# EAGLE design Carrier_for-Addons-V01-004 (EAGLE 9.1.1)
MAPLE-CUx Large Version
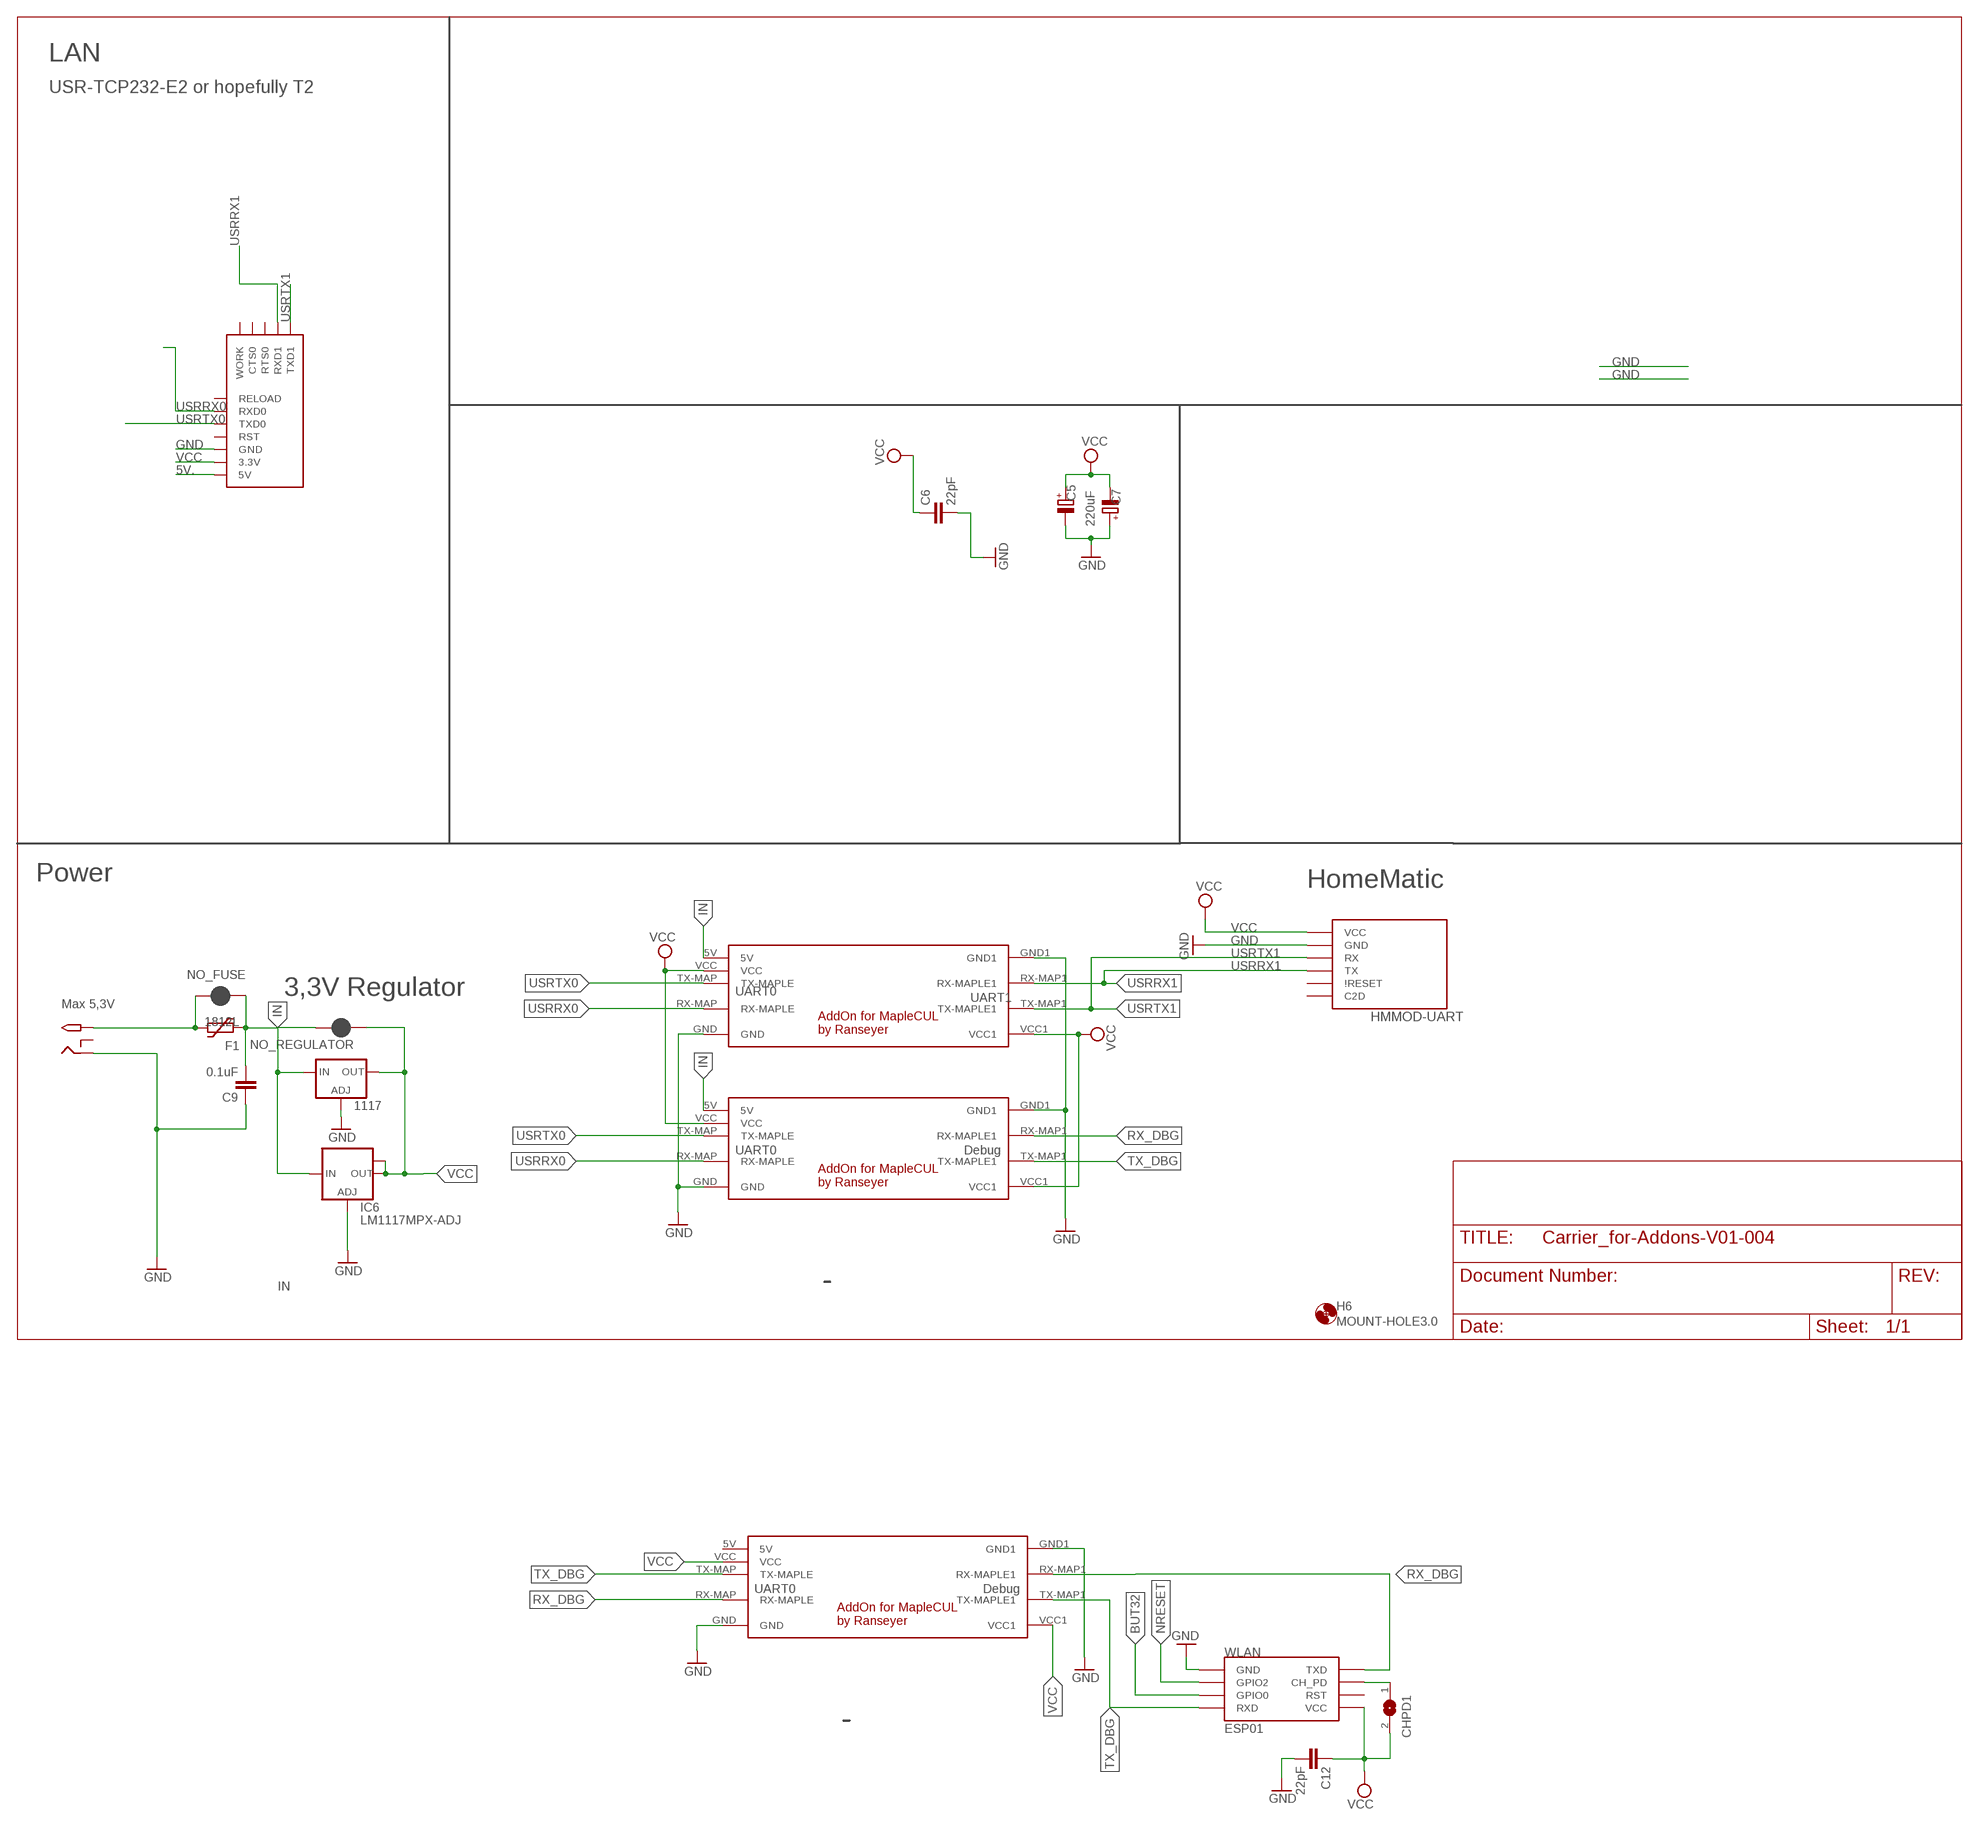
[diagram p0: schematic, sheet 1, part 1 of 2]
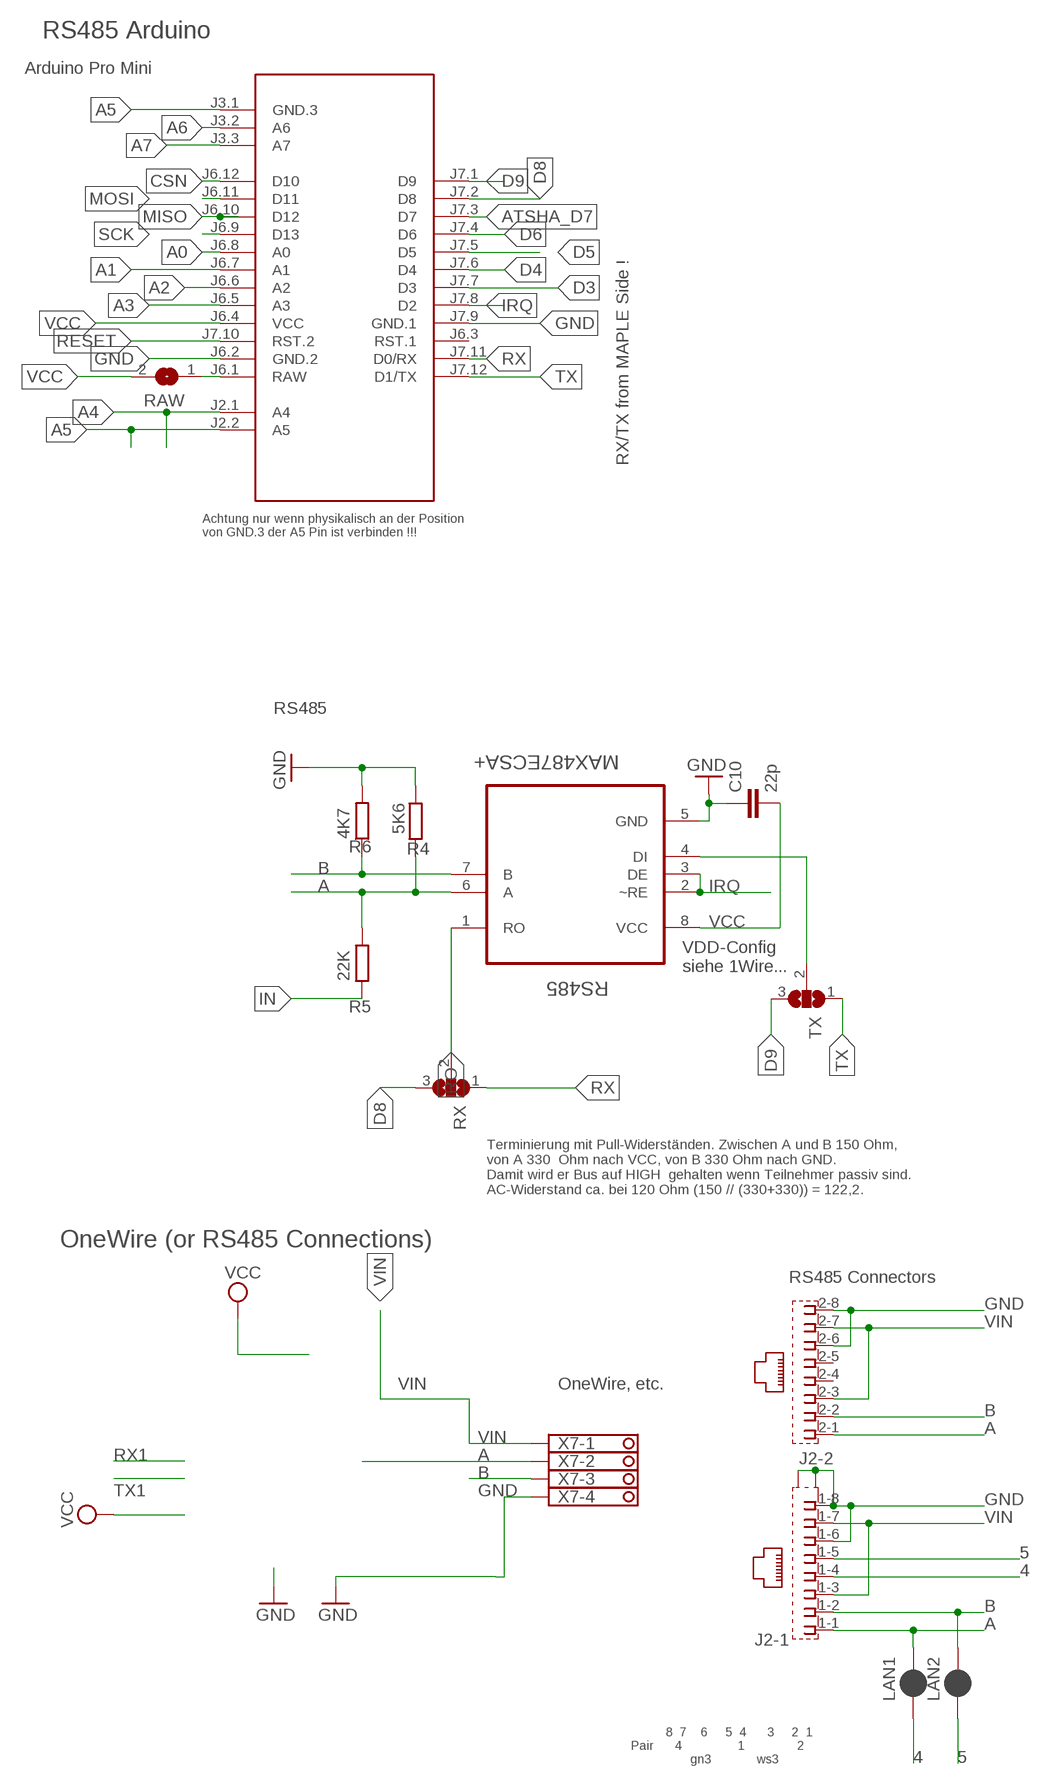
[diagram p1: schematic, sheet 1, part 2 of 2]

## Parts
1117  LD117ADT50TR  [DPACK]
C5  220uF  CPOL-EUE5-8.5  [E5-8,5]
C6  22pF  C-EUC0805  [C0805]
C7  CPOL-EUSMCE  [SMC_E]
C9  0.1uF  C-EUC1206  [C1206]
C10  22p  C-EUC0805  [C0805]
C12  22pF  C-EUC0805  [C0805]
CHPD1  SJ  [SJ]
F1  1812L  [1812L]
H6  MOUNT-HOLE3.0  [3,0]
HMMOD-UART  HM-MOD-UARTDIL  [HM-MOD-UART-DIL]
IC6  LM1117MPX-ADJ  [SOT223]
J2  RJ45_2X_S  [RJ45_2X_S]
LAN1  JUMPER-SMT_2_NC_PASTE_SILK  [SMT-JUMPER_2_NC_PASTE_SILK]
LAN2  JUMPER-SMT_2_NC_PASTE_SILK  [SMT-JUMPER_2_NC_PASTE_SILK]
M1  ARDUINO-PRO-MINI-3.3V#NP  [ARDUINO-PRO-MINI#NP]
NO_FUSE  JUMPER-SMT_2_NC_PASTE_NO-SILK  [SMT-JUMPER_2_NC_PASTE_NO-SILK]
NO_REGULATOR  JUMPER-SMT_2_NC_PASTE_NO-SILK  [SMT-JUMPER_2_NC_PASTE_NO-SILK]
R4  5K6  R-EU_R0805  [R0805]
R5  22K  R-EU_R0805  [R0805]
R6  4K7  R-EU_R0805  [R0805]
RAW  SJ  [SJ]
RS485  MAX487ECSA+  [SOIC127P600X175-8N]
RX  SJ2W  [SJ_2]
TX  SJ2W  [SJ_2]
U$1  MAPLE-CUL-ADDON-V01  [MAPLE-CUL-V01]
U$2  2.1MMJACKTHM  [PJ-102A]
U$3  MAPLE-CUL-ADDON-V01  [MAPLE-CUL-V01]
U$4  MAPLE-CUL-ADDON-V01  [MAPLE-CUL-V01]
U$5  USR-TCP232-E2  [USR-TCP232-E2]
WLAN  ESP01  [ESP01]
X7  1751264  [1751264]

## Nets
4: J2.1-4 LAN1.1
5: J2.1-5 LAN2.1
5V.: U$5.5V
A: J2.1-1 J2.2-1 LAN1.2 R4.2 R5.2 RS485.6(A) X7.2
A0: M1.J6.8(A0)
A1: M1.J6.7(A1)
A2: M1.J6.6(A2)
A3: M1.J6.5(A3)
A4: M1.J2.1(A4)
A5: M1.J2.2(A5) M1.J3.1(GND.3)
A6: M1.J3.2(A6)
A7: M1.J3.3(A7)
ATSHA_D7: M1.J7.3(D7)
B: J2.1-2 J2.2-2 LAN2.2 R6.1 RS485.7(B) X7.3
BUT32: WLAN.GPIO0
CSN: M1.J6.12(D10)
D3: M1.J7.7(D3)
D4: M1.J7.6(D4)
D5: M1.J7.5(D5)
D6: M1.J7.4(D6)
D8: M1.J7.2(D8) RX.3
D9: M1.J7.1(D9) TX.3
DI1: RS485.4(DI) TX.2
GND [Power]: 1117.1(ADJ) C5.- C6.2 C7.+ C9.1 C10.1 C12.2 HMMOD-UART.2(GND) IC6.1(ADJ) J2.1-6 J2.1-8 J2.2-6 J2.2-8 J2.G1(-1:S2) J2.G3(-1:S1) M1.J6.2(GND.2) M1.J7.9(GND.1) R4.1 R6.2 RS485.5(GND) U$1.GND U$1.GND1 U$2.RING U$3.GND U$3.GND1 U$4.GND U$4.GND1 U$5.GND WLAN.GND X7.4
IN [Power]: 1117.3(IN) C9.2 F1.P$1 IC6.3(IN) NO_FUSE.1 NO_REGULATOR.2 R5.1 U$3.5V U$4.5V
IRQ: M1.J7.8(D2) RS485.2(~RE) RS485.3(DE)
MISO: M1.J6.10(D12)
MOSI: M1.J6.11(D11)
N$2: CHPD1.1 WLAN.CH_PD
NRESET: WLAN.GPIO2
RAW1 [Power]: M1.J6.1(RAW) RAW.1
RESET: M1.J7.10(RST.2)
RO: RS485.1(RO) RX.2
RX: M1.J7.11(D0/RX) RX.1
RX_DBG: U$1.RX-MAP1(RX-MAPLE1) U$1.RX-MAP(RX-MAPLE) U$4.RX-MAP1(RX-MAPLE1) WLAN.TX(TXD)
SCK: M1.J6.9(D13)
TX: M1.J7.12(D1/TX) TX.1
TX_DBG: U$1.TX-MAP1(TX-MAPLE1) U$1.TX-MAP(TX-MAPLE) U$4.TX-MAP1(TX-MAPLE1) WLAN.RX(RXD)
USRRX0: U$3.RX-MAP(RX-MAPLE) U$4.RX-MAP(RX-MAPLE) U$5.RXD0
USRRX1: HMMOD-UART.5(TX) U$3.RX-MAP1(RX-MAPLE1) U$5.RXD1
USRTX0: U$3.TX-MAP(TX-MAPLE) U$4.TX-MAP(TX-MAPLE) U$5.TXD0
USRTX1: HMMOD-UART.6(RX) U$3.TX-MAP1(TX-MAPLE1) U$5.TXD1
VCC [Power]: 1117.4(OUT) C5.+ C6.1 C7.- C10.2 C12.1 CHPD1.2 HMMOD-UART.1(VCC) IC6.2(OUT) IC6.TAB(OUT1) M1.J6.4(VCC) NO_REGULATOR.1 RAW.2 RS485.8(VCC) U$1.VCC U$1.VCC1 U$3.VCC U$3.VCC1 U$4.VCC U$4.VCC1 U$5.3.3V WLAN.VCC
VIN [Power]: F1.P$2 J2.1-3 J2.1-7 J2.2-3 J2.2-7 NO_FUSE.2 U$2.TIP X7.1
Unconnected: HMMOD-UART.3(C2D) HMMOD-UART.4(\!RESET) J2.2-4 J2.2-5 M1.J6.3(RST.1) U$1.5V U$2.RING_SW U$5.CTS0 U$5.RELOAD U$5.RST U$5.RTS0 U$5.WORK WLAN.RST

## Notes on the sheet
- LAN
- USR-TCP232-E2 or hopefully T2
- RS485 Arduino
- Arduino Pro Mini
- RX/TX from MAPLE Side !
- Achtung nur wenn physikalisch an der Position 
  von GND.3 der A5 Pin ist verbinden !!!
- RS485
- VDD-Config
  siehe 1Wire...
- Power | HomeMatic
- Terminierung mit Pull-Widerständen. Zwischen A und B 150 Ohm,
  von A 330  Ohm nach VCC, von B 330 Ohm nach GND. 
  Damit wird er Bus auf HIGH  gehalten wenn Teilnehmer passiv sind.
  AC-Widerstand ca. bei 120 Ohm (150 // (330+330)) = 122,2.
- OneWire (or RS485 Connections)
- 3,3V Regulator | UART0
- UART1 | RS485 Connectors
- Max 5,3V
- OneWire, etc.
- UART0 | Debug
- 8  7    6     5  4      3     2  1
  Pair      4                1               2
                   gn3             ws3
- UART0 | Debug

## Library data of the parts
1117 = v-reg:LD117A?*: Low drop fixed and adjustable positive voltage regulators 1 A Source: http://www.st.com/stonline/products/literature/ds/7194/ld1117axx.pdf
C5 = rcl:CPOL-EU: POLARIZED CAPACITOR, European symbol
C6 C9 C10 C12 = rcl:C-EU: CAPACITOR, European symbol
C7 = rcl:CPOL-EU: POLARIZED CAPACITOR, European symbol; SPICEPREFIX: C
CHPD1 RAW = jumper:SJ: SMD solder JUMPER
F1 = ptc-littlefuse:1812L
H6 = holes:MOUNT-HOLE: MOUNTING HOLE with drill center marker
HMMOD-UART = wireless:HM-MOD-UART: eQ3 HM-MOD-UART-AW-SH2 wireless module for 868 MHz. DIL version for mounting with pin header (antenna upwards) and SMD variant available (antenna downwards).
IC6 = lm1117:LM1117MPX-ADJ
J2 = RJ45:RJ45_2X_S: AMP connector
LAN1 LAN2 NO_FUSE NO_REGULATOR = SparkFun-Jumpers:JUMPER-SMT_2_NC_PASTE: Normally closed solder jumper This jumper has an aperture in the stencil to allow solder paste to bridge the split in the wire so it's normally closed (NC). Wick off the solder to open the connection. Reapply solder to reclose the connection.
M1 = diy-modules:ARDUINO-PRO-MINI-*#NP: Arduino Pro Mini without programming pads
R4-R6 = rcl:R-EU_: RESISTOR, European symbol
RS485 = Maxim_By_element14_Batch_1:MAX487ECSA+: Low-Power, Slew-Rate-Limited RS-485/RS-422 Transceivers; MPN: MAX487ECSA+; OC_FARNELL: 9724532; OC_NEWARK: 68K4803; PACKAGE: SOIC-8; SUPPLIER: Maxim
RX TX = jumper:SJ2W: SMD solder JUMPER
U$1 U$3 U$4 = Martin-Communication-V4:MAPLE-CUL-ADDON-V01: AddOn for MAPLE-CUL V4.x
U$2 = adafruit:2.1MMJACK: 2.1mm x 5.5mm THM DC jack with internal switch. Digikey part #PJ-102A, 4UCON part #05537 2.1mm x 5.5mm SMT DC jack with internal switch. Digikey part #PJ-002A-SMT, 4UCON part #03267 By microbuilder.eu & adafruit.com
U$5 = #Usr-tcp232:USR-TCP232-E2
WLAN = esp8266modules:ESP01: ESP8266 Wifi module 01
X7 = con-phoenix-350:1751264: MKDS 1/ 4-3,5 Printklemme Nennstrom: 10 A Bemessungsspannung: 160 V Raster: 3,5 mm Polzahl: 4 Montageart: Löten Anschlussart: Schraubanschluss Anschlussrichtung vom Leiter zur Platine: 0° Source: http://eshop.phoenixcontact.com .. 1751264.pdf; MPN: 1751264; OC_FARNELL: unknown; OC_NEWARK: 10R0934

## Net classes
0 default: width 0.457 mm
1 Power: width 0.914 mm

## Board
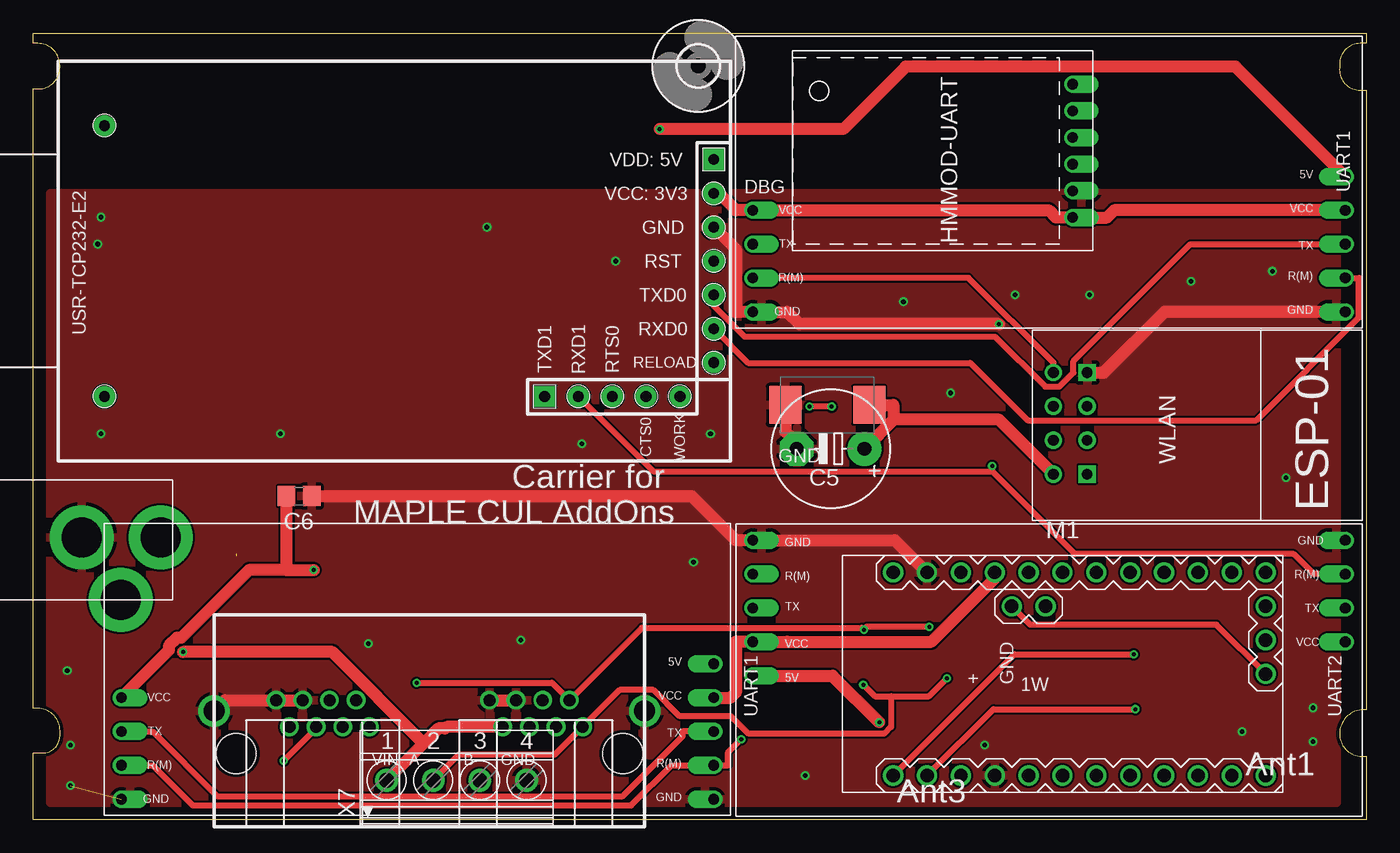
[diagram p2: board, top side]
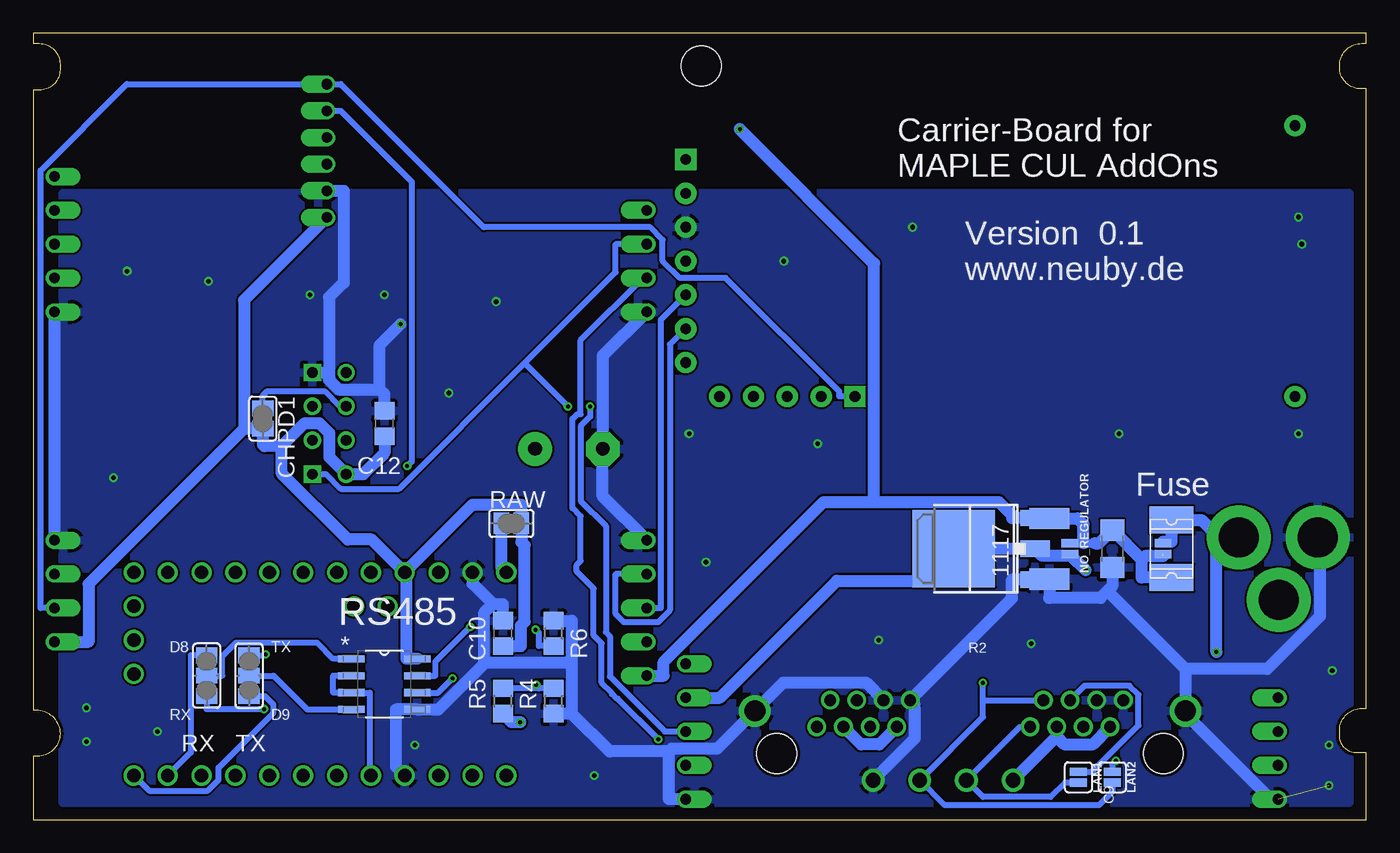
[diagram p3: board, bottom side, seen from below]

Size 100 x 59 mm. Coordinates in mm from the lower left corner, seen from the top.
Outline: 0,0 0,5 0.71,5 arc90 2,6.29 2,6.67 arc90 0.32,8.35 0,8.35 0,37 0,54.83 0.39,54.83 arc90 2,56.44 2,56.57 arc90 0.33,58.24 0,58.24 0,59 100,59 100,58.24 99.54,58.24 arc90 98,56.7 98,56.41 arc90 99.41,54.75 100,54.75 100,8.24 99.8,8.24 arc90 98,6.44 arc90 99.69,4.75 100,4.75 100,0 0,0
Copper layers (1*16): Top 0.035mm / dielectric 1.5mm / Bottom 0.035mm
Design rules "SeeedStudio_2layer_DRU_no_angle_20140221": minimum track width 6mil, minimum drill 12mil, track to track 6mil, track to pad 6mil, pad to pad 6mil, via to via 6mil, smd to smd 0mil, copper to edge 10mil, drill to drill 10mil, minimum pad ring 10mil, minimum via ring 6mil, stop-mask expansion 2mil, vias tented up to drill 100mil, thermal gap 10mil

### Footprints (pad centres in the part's own frame; a part is rotated, then mirrored left to right if it is on the bottom)
DPACK = smd 1.6 x 3: 1 -2.28,-4.8; 3 2.28,-4.8 | smd 5.8 x 6.2: 4 0,2.38
E5-8,5 = drill 1.016 pad 2.54: + -2.54,0 | drill 1.016 pad 2.54 octagon: - 2.54,0
C0805 = smd 1.3 x 1.5: 1 -0.95,0; 2 0.95,0
SMC_E = smd 2.4 x 2.8: + -3.15,0; - 3.15,0
C1206 = smd 1.6 x 1.8: 1 -1.4,0; 2 1.4,0
SJ = smd 1.168 x 1.6: 1 -0.762,0; 2 0.762,0
1812L = smd 2.03 x 3.3: P$1 -2.16,0; P$2 2.16,0
3,0 = hole 3: 0,0
HM-MOD-UART-DIL = drill 0.8 offset: 1 0,12; 2 0,10; 3 0,8; 4 0,6; 5 0,4; 6 0,2
SOT223 = smd 1.219 x 2.235: 1 -2.311,-3.099; 2 0,-3.099; 3 2.311,-3.099 | smd 3.6 x 2.2: TAB 0,3.099
RJ45_2X_S = drill 0.889: 1-1 -4.5,2; 1-2 -5.5,4; 1-3 -6.5,2; 1-4 -7.5,4; 1-5 -8.5,2; 1-6 -9.5,4; 1-7 -10.5,2; 1-8 -11.5,4; 2-1 11.5,2; 2-2 10.5,4; 2-3 9.5,2; 2-4 8.5,4; 2-5 7.5,2; 2-6 6.5,4; 2-7 5.5,2; 2-8 4.5,4 | drill 1.575 pad 2.184: G1 -16.15,3.2; G3 16.15,3.2 | hole 3: -14.5,0; 14.5,0
SMT-JUMPER_2_NC_PASTE_SILK = smd 0.635 x 1.27: 1 -0.406,0; 2 0.406,0
ARDUINO-PRO-MINI#NP = drill 1: J2.1 -1.27,5.08; J2.2 -3.81,5.08; J3.1 15.24,0; J3.2 15.24,2.54; J3.3 15.24,5.08; J6.1 -12.7,7.62; J6.2 -10.16,7.62; J6.3 -7.62,7.62; J6.4 -5.08,7.62; J6.5 -2.54,7.62; J6.6 0,7.62; J6.7 2.54,7.62; J6.8 5.08,7.62; J6.9 7.62,7.62; J6.10 10.16,7.62; J6.11 12.7,7.62; J6.12 15.24,7.62; J7.1 15.24,-7.62; J7.2 12.7,-7.62; J7.3 10.16,-7.62; J7.4 7.62,-7.62; J7.5 5.08,-7.62; J7.6 2.54,-7.62; J7.7 0,-7.62; J7.8 -2.54,-7.62; J7.9 -5.08,-7.62; J7.10 -7.62,-7.62; J7.11 -10.16,-7.62; J7.12 -12.7,-7.62
SMT-JUMPER_2_NC_PASTE_NO-SILK = smd 0.635 x 1.27: 1 -0.406,0; 2 0.406,0
R0805 = smd 1.3 x 1.5: 1 -0.95,0; 2 0.95,0
SOIC127P600X175-8N = smd 1.981 x 0.533: 1 -2.464,1.905; 2 -2.464,0.635; 3 -2.464,-0.635; 4 -2.464,-1.905; 5 2.464,-1.905; 6 2.464,-0.635; 7 2.464,0.635; 8 2.464,1.905
SJ_2 = smd 1.168 x 1.6: 1 -1.524,0; 2 0,0; 3 1.524,0
MAPLE-CUL-V01 = drill 0.8 offset: 5V 1.27,2.54; GND 1.27,12.7; GND1 45.72,12.7; RX-MAP 1.27,10.16; RX-MAP1 45.72,10.16; TX-MAP 1.27,7.62; TX-MAP1 45.72,7.62; VCC 1.27,5.08; VCC1 45.72,5.08
PJ-102A = drill 3 pad 4.8: RING 0.1,-3.39; RING_SW -4.6,-6.29; TIP 0.1,-9.29
USR-TCP232-E2 = drill 0.8 pad 1.6: 3.3V 1.27,9.906; CTS0 6.35,25.146; GND 1.27,12.446; P$13 46.99,25.146; P$14 46.99,4.826; RELOAD 1.27,22.606; RST 1.27,14.986; RTS0 8.89,25.146; RXD0 1.27,20.066; RXD1 11.43,25.146; TXD0 1.27,17.526; WORK 3.81,25.146 | drill 0.8 pad 1.6 square: 5V 1.27,7.366; TXD1 13.97,25.146
ESP01 = drill 0.8: CH_PD -1.285,-8.178; GPIO0 1.255,-5.638; GPIO2 -1.285,-5.638; RST 1.255,-8.178; TX -3.825,-8.178; VCC 3.795,-8.178 | drill 0.8 square: GND -3.825,-5.638; RX 3.795,-5.638
1751264 = drill 1.1 pad 1.7: 1 -5.25,-0.1; 2 -1.75,-0.1; 3 1.75,-0.1; 4 5.25,-0.1

### Placement (x,y rotation side)
1117  28.57,20.32 90 bottom
C5  59.82,27.81 180 top
C6  19.94,24.27 0 top
C7  59.56,31.11 0 top
C9  19.05,20.32 90 bottom
C10  64.77,13.97 270 bottom
C12  73.66,29.72 90 bottom
CHPD1  82.78,30.09 270 bottom
F1  14.61,20.32 90 bottom
H6  49.89,56.55 0 top
HMMOD-UART  77.98,57.18 180 top
IC6  27.94,20.32 90 bottom
J2  29.72,4.95 0 top
LAN1  21.59,3.17 270 bottom
LAN2  19.05,3.17 270 bottom
M1  77.22,10.92 0 top
NO_FUSE  15.24,20.32 90 bottom
NO_REGULATOR  22.23,20.32 90 bottom
R4  60.96,8.89 90 bottom
R5  64.77,8.89 90 bottom
R6  60.96,13.97 90 bottom
RAW  64.14,22.23 0 bottom
RS485  73.66,10.16 0 bottom
RX  87,10.79 90 bottom
TX  83.82,10.79 270 bottom
U$1  52.32,14.22 180 top
U$2  0.25,21.08 90 top
U$3  52.7,8.26 0 top
U$4  99.69,50.8 180 top
U$5  52.32,56.9 180 top
WLAN  84.71,29.72 270 top
X7  31.75,3.05 0 top

### Tracks (layer width: path | path; a pad name or v marks a point on that pad's centre or on a via)
4
  Bottom 0.457: LAN1.1 20.57,3.58 17.09,7.06 17.09,9.38 17.76,10.04 21.13,10.04 J2.1-4
5  (via drill 0.3 pad 0.61)
  Top 0.457: J2.1-5 21.22,6.85 v18.77,4.4
  Bottom 0.457: v18.77,4.4 19.05,4.13 LAN2.1
A  (via drill 0.3 pad 0.61)
  Top 0.457: 64.36,9.25 64.36,6.95 63.85,6.44 53.66,6.44 52.34,7.76 48.48,7.76 46.52,9.72 43.99,9.72 J2.2-1 39.14,4.88 31.93,4.88 X7.2 | 64.36,9.25 67.2,9.25 v68.55,10.6 | v62.27,10.12 63.13,9.25 64.36,9.25
  Bottom 0.457: RS485.6 69.62,9.53 v68.55,10.6 | 62.09,9.84 R5.2 | R4.2 62.09,9.84 | v62.27,10.12 62.09,9.94 62.09,9.84 | LAN1.2 22.61,2.77 23.68,1.69 28.74,1.69 X7.2 26,6.95 J2.1-1
A5
  Top 0.457: M1.J3.1 88.76,14.62 74.79,14.62 M1.J2.2
B  (via drill 0.3 pad 0.61)
  Top 0.457: v67.22,14.47 62.53,14.47 v62.31,14.25 62.16,14.39 45.66,14.39 J2.2-2 38.91,10.26 v28.75,10.26
  Bottom 0.457: RS485.7 69.83,10.79 69.83,11.86 v67.22,14.47 | R6.1 62.09,13.02 62.09,14.03 v62.31,14.25 | 28.75,8.95 v28.75,10.26 | 28.75,8.95 28.75,7.7 X7.3 31.63,1.08 20.04,1.08 19.05,2.07 LAN2.2 | 28.75,8.95 J2.1-2
D8
  Bottom 0.457: RX.3 88.18,12.32 88.18,5.04 M1.J7.2
D9
  Bottom 0.457: TX.3 82.64,9.27 81.98,8.61 81.98,8.01 86.11,3.88 86.11,2.97 86.91,2.17 91.32,2.17 M1.J7.1
DI1
  Bottom 0.457: TX.2 81.98,10.79 79.44,8.26 RS485.4
GND  (via drill 0.3 pad 0.61, 0.35)  (1 unrouted)
  Top 0.914: C6.2 49.39,24.27 52.71,20.95 U$3.GND 64.64,20.95 M1.J6.2 | C7.+ 56.41,29.11 57.28,28.24 C5.- | v72.45,37.17 57.48,37.17 56.55,38.1 U$4.GND1 52.71,38.1 52.71,42.79 U$5.GND | J2.1-6 J2.1-8 14.37,8.95 J2.G1 | J2.2-8 J2.2-6 | WLAN.GND 80.33,33.54 84.89,38.1 U$4.GND
  Bottom 0.914: 19.41,17.15 19.93,16.63 23.77,16.63 1117.1 23.81,18.01 IC6.1 25.7,18.01 26.57,18.01 26.57,16.6 J2.2-8 33.87,8.61 33.87,6.08 X7.4 | 19.41,17.15 19.05,17.51 C9.1 | 19.41,17.15 18.78,16.52 13.57,11.31 | 52.32,5.1 52.09,5.33 48.69,5.33 J2.G3 43.74,10.29 37.55,10.29 J2.2-6 | 52.32,5.1 52.32,1.52 U$1.GND | 52.32,5.1 56.76,5.1 59.6,7.94 | U$3.GND 57.28,24.26 C5.- 57.28,34.8 U$4.GND1 | 74.01,32.28 73.66,31.93 C12.2 | 77.81,33.54 77.81,32.99 77.1,32.28 74.01,32.28 | 74.01,32.28 74.01,35.61 v72.45,37.17 | HMMOD-UART.2 76.71,47.18 76.71,40.28 77.81,39.19 77.81,33.54 | U$2.RING 3.47,21.01 3.47,15.26 7.42,11.31 13.57,11.31 | 13.57,11.31 J2.G1 13.57,7.93 7.16,1.52 U$1.GND1 | 59.6,11.74 59.6,7.94 | 59.6,11.74 59.6,14.92 R6.2 | 59.6,11.74 66.11,11.74 | 66.11,11.74 | 66.11,11.74 66.17,11.8 66.17,15.53 65.52,16.18 | 66.11,11.74 69.6,8.26 RS485.5 72.8,8.26 72.8,3.96 M1.J7.9 | 65.52,16.18 64.77,16.18 C10.1 | M1.J6.2 67.06,17.71 65.52,16.18 | 59.6,7.94 R4.1 | U$4.GND U$3.GND1 | WLAN.GND 77.81,33.54
  other vias: 2.79,2.54 2.79,5.59 2.54,11.18 5.08,45.21 4.83,43.18 5.08,28.96 18.54,28.96 34.04,44.45 43.69,41.91 36.58,13.46 25.15,13.21 57.91,3.3 90.68,6.6 71.37,5.59 96.01,5.84 96.01,8.38 93.98,25.65 92.96,41.15 86.87,40.39 73.66,39.37 79.25,39.37 65.28,38.86 68.83,32 49.53,19.3 41.15,28.19 50.8,28.96
  pour Bottom: 1.27,1.27 97.79,1.27 97.79,46.99 1.27,46.99
  pour Top: 1.27,46.99 97.79,46.99 97.79,1.27 1.27,1.27
IN  (via drill 0.3 pad 0.61)  (1 unrouted)
  Top 0.914: U$4.5V 90.19,56.5 65.45,56.5 60.76,51.81 v46.99,51.81 | U$3.5V 59.97,10.79 v63.47,7.3
  Bottom 0.635: NO_REGULATOR.2 21.21,20.73 20.36,20.73
  Bottom 0.914: F1.P$1 16.86,18.16 16.86,19.54 | 36.92,23.83 27.54,23.83 26.57,22.86 26.57,22.63 25.7,22.63 IC6.3 23.81,22.63 1117.3 21.66,22.6 21.21,22.14 21.21,20.73 | 36.92,23.83 40.7,23.83 52.71,11.82 52.71,10.79 U$3.5V | 36.92,23.83 36.92,41.73 v46.99,51.81 | 16.86,19.54 C9.2 20.04,20.73 20.36,20.73 | v63.47,7.3 64.13,7.3 R5.1 | 16.86,19.54 16.79,19.54 16.51,19.81 16.14,19.81 16.13,19.8 15.71,19.8 15.68,19.77 15.24,19.77
IRQ
  Bottom 0.457: M1.J7.8 74.75,3.38 74.75,9.53 RS485.3 76.81,9.53 77.5,9.53 77.5,10.79 RS485.2
N$2
  Bottom 0.457: CHPD1.1 82.78,31.82 82.5,32.1 78.1,32.1 77.01,31 WLAN.CH_PD
RAW1
  Bottom 0.914: RAW.1 64.9,18.92 M1.J6.1
RO
  Bottom 0.457: RS485.1 77.5,12.06 78.72,13.29 84.77,13.29 85.81,12.25 85.81,10.79 RX.2
RX  (via drill 0.3 pad 0.61)
  Top 0.457: M1.J7.11 72.04,8.28 v82.67,8.28
  Bottom 0.457: RX.1 87,8.31 82.7,8.31 v82.67,8.28
RX_DBG  (via drill 0.3 pad 0.61)
  Top 0.457: v53.11,6.02 52.09,4.99 52.09,4.06 U$1.RX-MAP 47.87,4.06 44.85,1.05 11.96,1.05 8.95,4.06 U$1.RX-MAP1 | WLAN.TX 76.53,34.28 70.17,40.64 U$4.RX-MAP1
  Bottom 0.457: v53.11,6.02 56.16,9.07 56.23,9.07 56.58,9.42 56.58,9.49 57.35,10.26 57.35,13.2 57.96,13.81 57.96,17.33 59.24,18.61 59.24,19.11 58.93,19.42 58.93,22.75 59.54,23.36 59.54,30.07 59.19,30.43 58.93,30.43 58.93,35.97 54.27,40.64 U$4.RX-MAP1
TX  (via drill 0.3 pad 0.61)
  Top 0.457: M1.J7.12 73.62,12.4 v82.56,12.4
  Bottom 0.457: v82.56,12.4 82.64,12.32 TX.1
TX_DBG  (via drill 0.3 pad 0.61)
  Top 0.457: v59.9,30.98 v58.22,30.98 | U$1.TX-MAP 48.71,6.6 48.71,6.26 44.16,1.71 13.84,1.71 8.95,6.6 U$1.TX-MAP1
  Bottom 0.457: 63.15,34.24 56.32,41.07 56.32,43.18 U$4.TX-MAP1 | 63.15,34.24 72.57,24.82 76.94,24.82 78.04,25.92 WLAN.RX | 63.15,34.24 v59.9,30.98 | v58.22,30.98 58.22,30.23 58.93,29.52 58.93,23.92 57.05,22.04 57.05,14.07 56.74,13.76 56.74,10.73 52.62,6.6 U$1.TX-MAP
USRRX0
  Top 0.457: U$4.RX-MAP 99.46,40.64 99.46,37.65 91.75,29.95 74.61,29.95 70.29,34.26 53.63,34.26 U$5.RXD0
  Bottom 0.457: U$3.RX-MAP 56.32,18.41 56.32,15.44 55.69,14.81 53.12,14.81 52.23,15.7 52.23,35.65 U$5.RXD0
USRRX1  (via drill 0.3 pad 0.61)
  Top 0.457: 71.94,26.12 v71.94,26.54 | 71.94,26.12 78.15,19.92 94.58,19.92 96.08,18.41 U$3.RX-MAP1 | U$5.RXD1 46.52,26.12 71.94,26.12
  Bottom 0.457: v71.94,26.54 71.61,26.86 71.61,47.85 76.94,53.18 HMMOD-UART.5
USRTX0
  Top 0.457: U$5.TXD0 51.05,38.54 53.36,36.23 72.16,36.23 75.92,32.48 76.97,32.48 78.04,33.54 78.04,34.4 86.81,43.18 U$4.TX-MAP
  Bottom 0.457: U$5.TXD0 52.94,37.48 52.94,15.88 U$3.TX-MAP
USRTX1
  Bottom 0.457: U$3.TX-MAP1 99.46,15.88 99.46,48.71 92.99,55.18 HMMOD-UART.6 76.94,55.18 66.21,44.45 53.73,44.45 52.78,43.5 52.78,41.92 51.5,40.64 48.06,40.64 39.53,32.12 39.53,31.75 U$5.TXD1
VCC  (via drill 0.3 pad 0.61)
  Top 0.914: M1.J6.4 72.14,18.09 67.37,13.33 56.55,13.33 56.55,13.34 U$3.VCC 53.88,13.34 52.71,13.34 52.71,9.54 52.32,9.14 U$1.VCC | 18.99,18.73 16.19,18.73 11.11,13.65 10.79,13.65 10.16,13.02 10.16,12.7 U$1.VCC1 | 18.99,18.73 C6.1 | 18.99,18.73 v21.04,18.73 | C7.- 64.52,31.11 64.52,30.03 64.55,30 | 64.55,30 C5.+ | WLAN.VCC 72.45,30 64.55,30 | U$4.VCC 81.09,45.72 80.55,45.18 HMMOD-UART.1 76.71,45.18 76.18,45.72 U$4.VCC1 53.88,45.72 52.71,45.72 51.44,46.99 U$5.3.3V
  Bottom 0.635: 22.23,19.8 NO_REGULATOR.1
  Bottom 0.914: U$3.VCC1 95.85,13.34 95.85,17.66 84.19,29.33 | 84.19,29.33 83.92,29.33 CHPD1.2 82.78,28.13 82.66,28.02 81.36,28.02 | U$1.VCC 48.48,9.14 39.72,17.91 31.04,17.91 IC6.TAB 1117.4 IC6.2 24.32,19.8 22.23,19.8 22.11,19.8 v21.04,18.73 | M1.J6.4 67.04,23.64 63.37,23.64 RAW.2 63.37,20.82 63.13,20.57 63.13,14.85 63.41,14.57 63.41,13.02 C10.2 | M1.J6.4 74.6,21.01 76.42,21.01 81.36,25.95 81.36,28.02 | 81.36,28.02 79.63,29.74 78.54,29.74 77.8,29 77.8,27.19 WLAN.VCC 75.25,25.92 73.66,27.51 C12.1 | HMMOD-UART.1 84.19,38.97 84.19,29.33 | M1.J6.4 72,18.4 72,12.06 RS485.8
VIN  (via drill 0.3 pad 0.61)
  Top 0.914: 29.29,5.74 X7.1 | J2.2-7 31.01,6.95 30.88,6.83 30.38,6.83 29.29,5.74 | 29.29,5.74 22.45,12.58 v11.23,12.58
  Bottom 0.635: 15.24,20.84 NO_FUSE.2
  Bottom 0.914: 11.05,21.18 12.35,22.48 F1.P$2 14.61,20.86 15.23,20.86 15.24,20.84 | U$2.TIP 11.05,21.18 | v11.23,12.58 11.23,21 11.05,21.18 | 23.22,6.23 J2.1-3 | X7.1 23.22,6.23 | J2.1-7 20.55,5.62 22.61,5.62 23.22,6.23 | J2.2-7 36.53,5.64 37.91,5.64 J2.2-3

### Text on the board
tNames: DBG | UART1 | Carrier for / MAPLE CUL AddOns | GND | GND | 1W | + | UART1 | UART2 | VIN | A | B | GND | Ant1 | Ant3
bNames: Carrier-Board for / MAPLE CUL AddOns | Version 0.1 / www.neuby.de | Fuse | R2 | TX | D8 | D9 | RX | C9